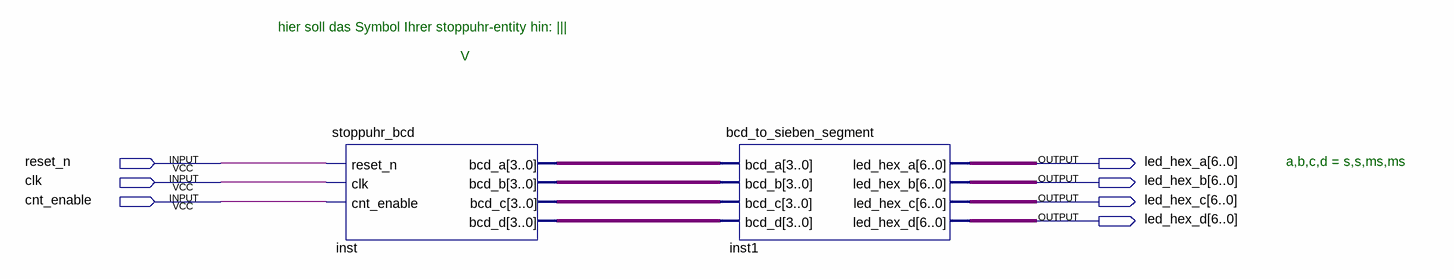
[diagram p0: schematic sheet]
// Quartus schematic stoppuhr.bdf as structural Verilog: 2 symbols, 7 pins
module stoppuhr (
  input  reset_n,
  input  clk,
  input  cnt_enable,
  output [6:0] led_hex_a,
  output [6:0] led_hex_b,
  output [6:0] led_hex_c,
  output [6:0] led_hex_d
);

  wire [3:0] inst_bcd_a, inst_bcd_b, inst_bcd_c, inst_bcd_d;

  stoppuhr_bcd inst (
    .reset_n(reset_n), .clk(clk), .cnt_enable(cnt_enable), .bcd_a(inst_bcd_a), .bcd_b(inst_bcd_b),
    .bcd_c(inst_bcd_c), .bcd_d(inst_bcd_d));
  bcd_to_sieben_segment inst1 (
    .bcd_a(inst_bcd_a), .bcd_b(inst_bcd_b), .bcd_c(inst_bcd_c), .bcd_d(inst_bcd_d), .led_hex_a(led_hex_a),
    .led_hex_b(led_hex_b), .led_hex_c(led_hex_c), .led_hex_d(led_hex_d));

  // Notes on the sheet:
  //   hier soll das Symbol Ihrer stoppuhr-entity hin: |||
  //   V
  //   a,b,c,d = s,s,ms,ms
endmodule
